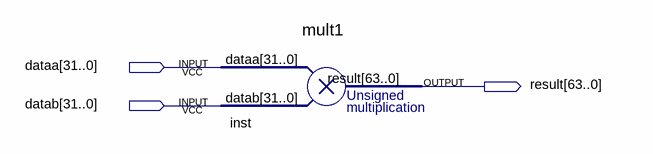
[diagram p0: schematic sheet]
// Quartus schematic Block1.bdf as structural Verilog: 1 symbols, 3 pins
module Block1 (
  input  [31:0] dataa,
  input  [31:0] datab,
  output [63:0] result
);

  mult1 inst (.dataa(dataa), .datab(datab), .result(result));
endmodule
